# Altium schematic sheet CAN.SchDoc
size A4
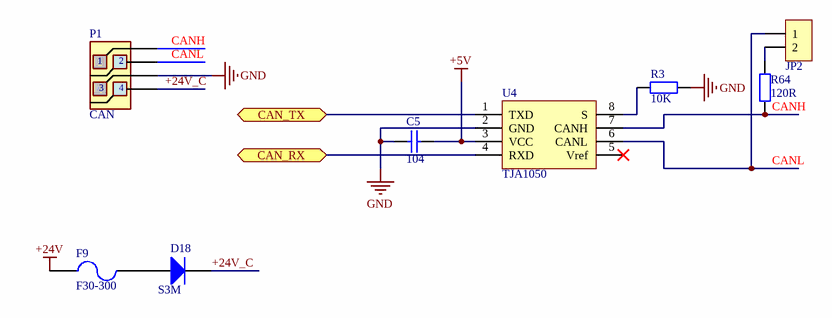
[diagram p0: CAN.SchDoc]

## Parts
C5  104  [C 0805]
D18  S3M  [SMC]
F9  F30-300  [FU 1812]
JP2  HDR-1X2  [HDR-1X2]  (value not drawn)
P1  CAN  [557-2x2]
R3  10K  [R 0805]
R64  120R  [R 0805]
U4  TJA1050  [SO8]

## Ports
CAN_RX, CAN_TX

## Nets
+5V: C5.2 U4.3(VCC)
+24V: F9.1
GND: C5.1 P1.3 R3.2 U4.2(GND)
+24V_C: D18.2 P1.4
CAN_RX: U4.4(RXD) ; port CAN_RX
CAN_TX: U4.1(TXD) ; port CAN_TX
CANH: P1.1 R64.2 U4.7(CANH)
CANL: JP2.1 P1.2 U4.6(CANL)
NetD18_1: D18.1 F9.2
NetJP2_2: JP2.2 R64.1
NetR3_1: R3.1 U4.8(S)

Not connected (* = marked no-connect by the designer): U4 5(Vref)*

## Notes on the sheet
- 设 计
- 制 图
- 审 核
- 类 别
- 签  字
- 日 期
- 产 品
- 名 称
- 零 件
- 板  名
- 数  量
- 共  张
- 第  张
- 批 准
- 文件编号
- 沈阳市创奇游乐设备有限公司

## Library data of the parts
C5 = Cap: Capacitor; Published: 8-Jun-2000; LatestRevisionDate: 17-Jul-2002; LatestRevisionNote: Re-released for DXP Platform.; Publisher: Altium Limited
D18 = Diode
F9 = Fuse 2: Fuse; Published: 8-Jun-2000; LatestRevisionDate: 17-Jul-2002; LatestRevisionNote: Re-released for DXP Platform.; PackageReference: PIN-W2/E2.8; Publisher: Altium Limited
JP2 = Header 2: 2P接插件; 版权归属: 源创客; BOM名称: 2P接插件; 学习资源: www.ooocke.com
P1 = CON4L
R3 R64 = Res1
U4 = SN65HVD230: CAN